# Altium schematic sheet STM32MP25XXAK_2_DDR3L-TOP.SchDoc: STM32MP25XXAK-TOP
size A3; Date: Not used; ApprovedBy: Not used; CheckedBy: Not used; Author: Not used; CompanyName: STMicroelectronics; DrawnBy: Not used; Engineer: Not used; Organization: Not used; Address1: Not used; Address2: Not used; Address3: Not used; Address4: Not used; DocumentNumber: Not used; Revision: Not used; SheetNumber: 2; SheetTotal: 7; CurrentTime: Not used; CurrentDate: Not used; Time: Not used; DocumentFullPathAndName: Not used; DocumentName: Not used; ModifiedDate: Not used; ImagePath: Not used; ProjectName: Not used; Application_BuildNumber: Not used
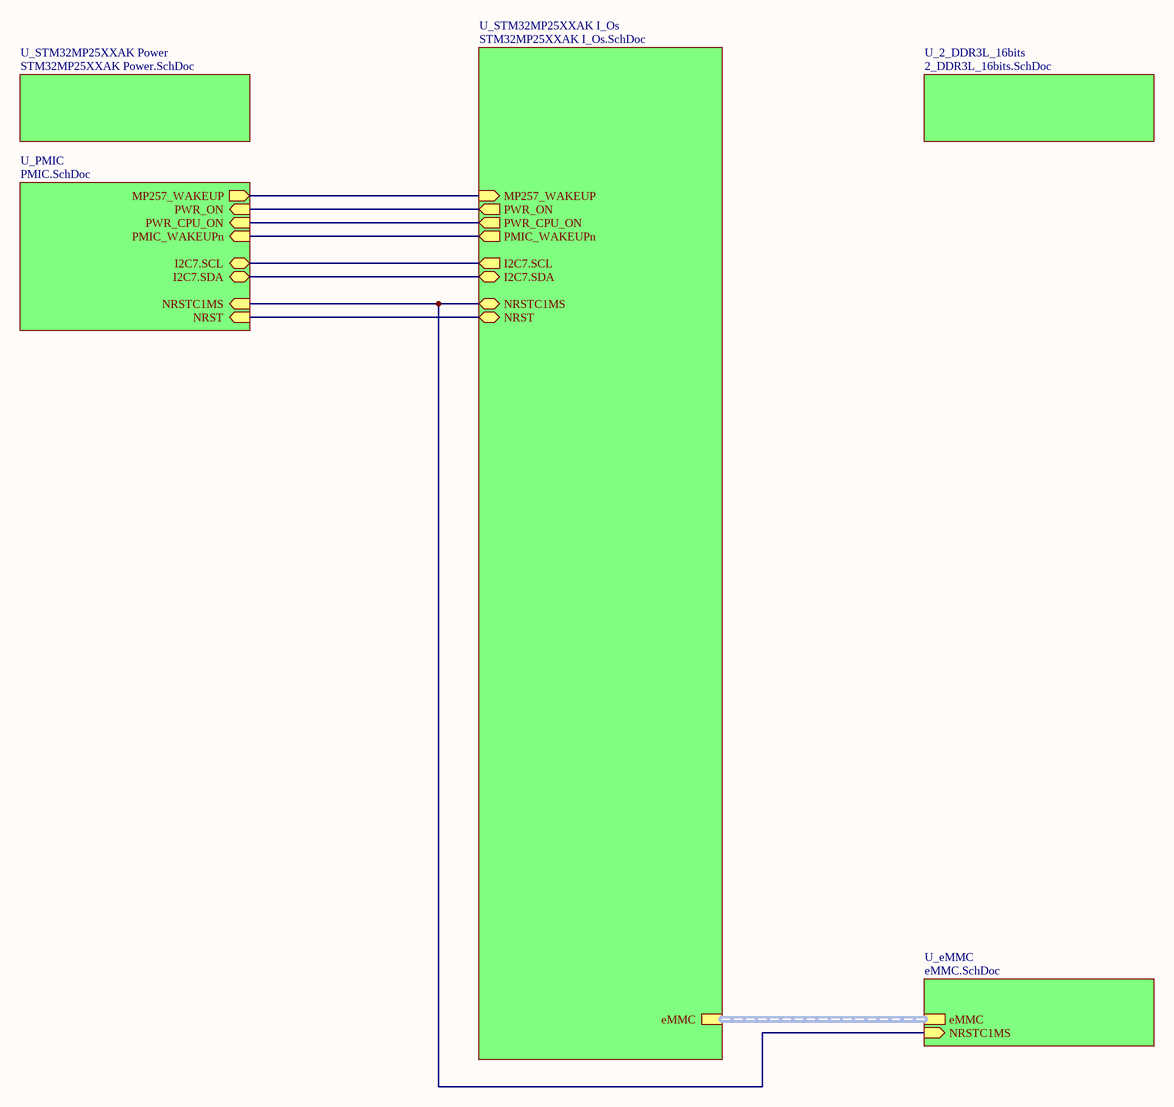
[diagram p0: STM32MP25XXAK_2_DDR3L-TOP.SchDoc]

## Sub-sheets
U_2_DDR3L_16bits = 2_DDR3L_16bits.SchDoc: no entries
U_eMMC = eMMC.SchDoc: eMMC (harness eMMC), NRSTC1MS (in)
U_PMIC = PMIC.SchDoc: PMIC_WAKEUPn (in), NRST (in), I2C7.SCL (bidir), PWR_ON (in), PWR_CPU_ON (in), NRSTC1MS (in), I2C7.SDA (bidir), MP257_WAKEUP (out)
U_STM32MP25XXAK I_Os = STM32MP25XXAK I_Os.SchDoc: NRST (bidir), PWR_ON (out), NRSTC1MS (bidir), I2C7.SDA (bidir), I2C7.SCL (out), PWR_CPU_ON (out), MP257_WAKEUP (in), PMIC_WAKEUPn (out), eMMC (harness eMMC)
U_STM32MP25XXAK Power = STM32MP25XXAK Power.SchDoc: no entries

## Nets
(unnamed): sheet U_STM32MP25XXAK I_Os/NRST, sheet U_PMIC/NRST
(unnamed): sheet U_STM32MP25XXAK I_Os/PWR_ON, sheet U_PMIC/PWR_ON
(unnamed): sheet U_STM32MP25XXAK I_Os/NRSTC1MS, sheet U_PMIC/NRSTC1MS, sheet U_eMMC/NRSTC1MS
(unnamed): sheet U_STM32MP25XXAK I_Os/I2C7.SDA, sheet U_PMIC/I2C7.SDA
(unnamed): sheet U_STM32MP25XXAK I_Os/I2C7.SCL, sheet U_PMIC/I2C7.SCL
(unnamed): sheet U_STM32MP25XXAK I_Os/PWR_CPU_ON, sheet U_PMIC/PWR_CPU_ON
(unnamed): sheet U_STM32MP25XXAK I_Os/MP257_WAKEUP, sheet U_PMIC/MP257_WAKEUP
(unnamed): sheet U_STM32MP25XXAK I_Os/PMIC_WAKEUPn, sheet U_PMIC/PMIC_WAKEUPn

## Buses and harness runs
harness sheet U_eMMC/eMMC = sheet U_STM32MP25XXAK I_Os/eMMC

## Notes on the sheet
- Title:
- Project:
- Size:
- Revision:
- Variant:
- A3
- -
- Date:
- Reference:
- Sheet:
- of